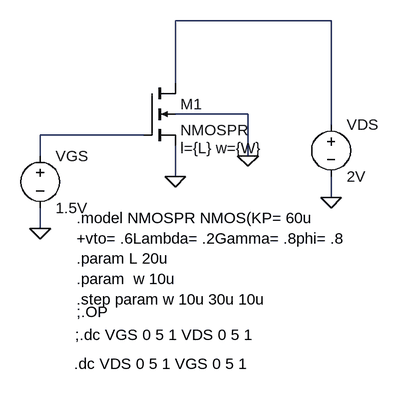
[diagram p0: schematic NMOS model.asc]
NMOS model.asc, the LTspice schematic file:
Version 4
SHEET 1 880 680
WIRE 496 48 256 48
WIRE 256 144 256 48
WIRE 368 192 256 192
WIRE 496 208 496 48
WIRE 208 224 48 224
WIRE 48 256 48 224
WIRE 368 256 368 192
WIRE 256 288 256 240
WIRE 496 320 496 288
WIRE 48 368 48 336
FLAG 48 368 0
FLAG 256 288 0
FLAG 496 320 0
FLAG 368 256 0
SYMBOL nmos4 208 144 R0
WINDOW 123 56 100 Left 2
SYMATTR InstName M1
SYMATTR Value NMOSPR
SYMATTR Value2 l={L} w={W}
SYMBOL voltage 48 240 R0
WINDOW 123 0 0 Left 0
WINDOW 39 0 0 Left 0
SYMATTR InstName VGS
SYMATTR Value 1.5V
SYMBOL voltage 496 192 R0
WINDOW 123 0 0 Left 0
WINDOW 39 0 0 Left 0
SYMATTR InstName VDS
SYMATTR Value 2V
TEXT 104 352 Left 2 !.model NMOSPR NMOS(KP= 60u\n+vto= .6Lambda= .2Gamma= .8phi= .8\n.param L 20u\n.param  w 10u\n.step param w 10u 30u 10u
TEXT 104 496 Left 2 !;.OP
TEXT 102 532 Left 2 !;.dc VGS 0 5 1 VDS 0 5 1
TEXT 100 576 Left 2 !.dc VDS 0 5 1 VGS 0 5 1

The netlist it stands for:
* NMOS model.asc
M1 N001 N002 0 0 NMOSPR l={L} w={W}
VGS N002 0 1.5V
VDS N001 0 2V
.model NMOS NMOS
.model PMOS PMOS
.lib standard.mos
.model NMOSPR NMOS(KP= 60u
+vto= .6Lambda= .2Gamma= .8phi= .8
.param L 20u
.param  w 10u
.step param w 10u 30u 10u
;.OP
;.dc VGS 0 5 1 VDS 0 5 1
.dc VDS 0 5 1 VGS 0 5 1
.backanno
.end